# Altium project stmf417 board.PrjPcb (part 1 of 4)
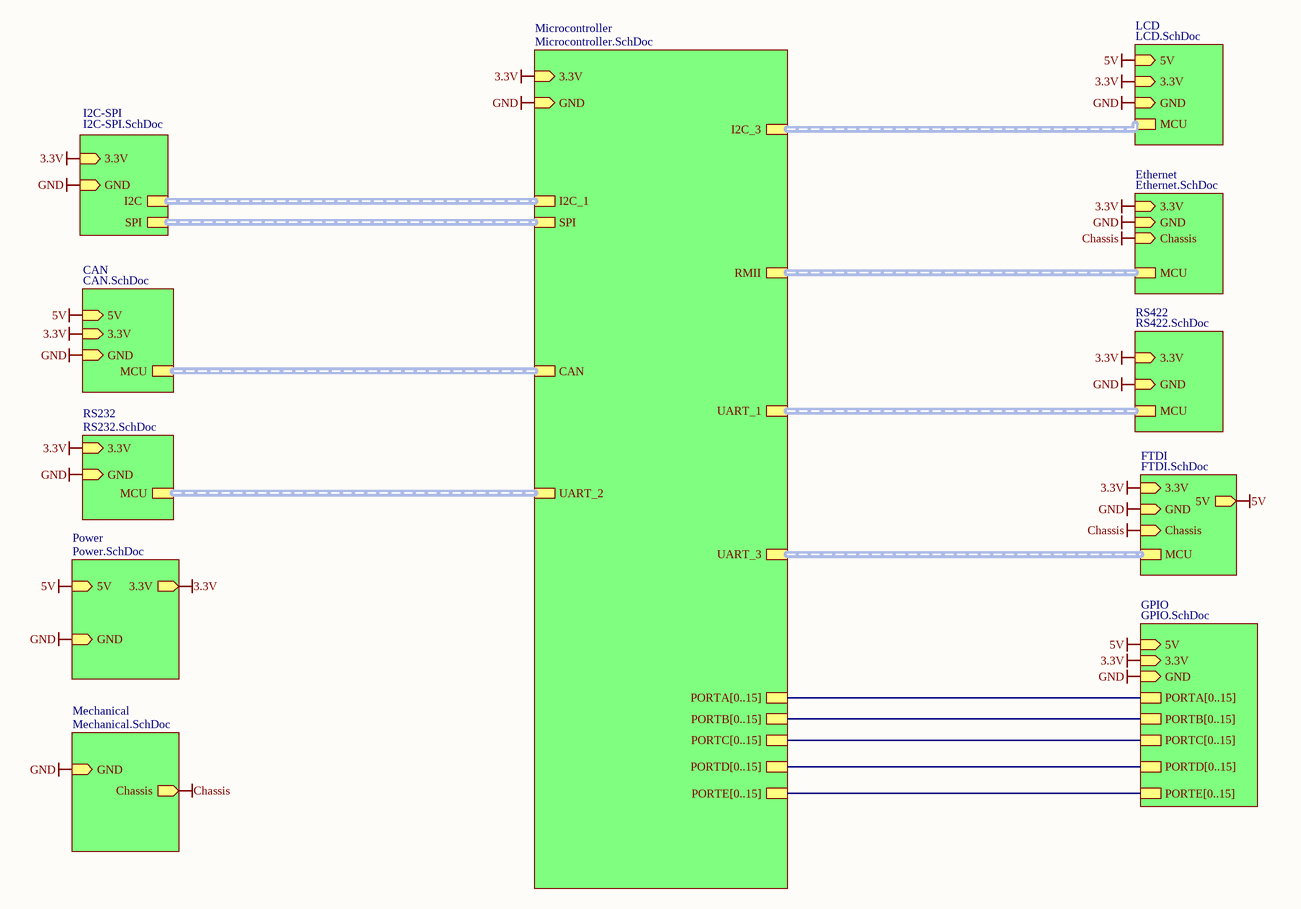
[diagram p0: main.SchDoc]
15 sheets, 357 parts. Net scope: strictly hierarchical (ports join the sheet entries above them; power ports are local).
Sheets:
  main.SchDoc
    CAN = CAN.SchDoc
    RS232 = RS232.SchDoc
    Power = Power.SchDoc
    Microcontroller = Microcontroller.SchDoc
    LCD = LCD.SchDoc
    Ethernet = Ethernet.SchDoc
    RS422 = RS422.SchDoc
    FTDI = FTDI.SchDoc
    GPIO = GPIO.SchDoc
      Bt1 = Button.SchDoc
      Bt2 = Button.SchDoc
      Bt3 = Button.SchDoc
      Sw1 = Switch.SchDoc
      Sw2 = Switch.SchDoc
      Sw3 = Switch.SchDoc
      LdR = Led Driver.SchDoc
      LdO = Led Driver.SchDoc
      LdY = Led Driver.SchDoc
      LdG = Led Driver.SchDoc
    Mechanical = Mechanical.SchDoc
    I2C-SPI = I2C-SPI.SchDoc

## Sheet main.SchDoc
size A3; SheetNumber: 1; SheetTotal: 15

### Sub-sheets
CAN = CAN.SchDoc: 3.3V (in), GND (in), MCU (harness CAN), 5V (in)
Ethernet = Ethernet.SchDoc: 3.3V (in), GND (in), MCU (harness RMII), Chassis (in)
FTDI = FTDI.SchDoc: 3.3V (in), GND (in), MCU (harness UART), 5V (out), Chassis (in)
GPIO = GPIO.SchDoc: 3.3V (in), GND (in), PORTA[0..15], PORTB[0..15], PORTC[0..15], PORTD[0..15], PORTE[0..15], 5V (in)
I2C-SPI = I2C-SPI.SchDoc: 3.3V (in), GND (in), SPI (harness SPI), I2C (harness I2C)
LCD = LCD.SchDoc: 3.3V (in), GND (in), MCU (harness I2C), 5V (in)
Mechanical = Mechanical.SchDoc: Chassis (out), GND (in)
Microcontroller = Microcontroller.SchDoc: 3.3V (in), GND (in), CAN (harness CAN), UART_2 (harness UART), SPI (harness SPI), I2C_3 (harness I2C), RMII (harness RMII), UART_1 (harness UART), UART_3 (harness UART), I2C_1 (harness I2C), PORTA[0..15], PORTB[0..15], PORTC[0..15], PORTD[0..15], PORTE[0..15]
Power = Power.SchDoc: 5V (in), GND (in), 3.3V (out)
RS232 = RS232.SchDoc: 3.3V (in), GND (in), MCU (harness UART)
RS422 = RS422.SchDoc: 3.3V (in), GND (in), MCU (harness UART)

### Nets
3.3V: sheet CAN/3.3V, sheet RS232/3.3V, sheet Power/3.3V, sheet Microcontroller/3.3V, sheet LCD/3.3V, sheet Ethernet/3.3V, sheet RS422/3.3V, sheet FTDI/3.3V, sheet GPIO/3.3V, sheet I2C-SPI/3.3V
5V: sheet CAN/5V, sheet Power/5V, sheet LCD/5V, sheet FTDI/5V, sheet GPIO/5V
Chassis: sheet Ethernet/Chassis, sheet FTDI/Chassis, sheet Mechanical/Chassis
GND: sheet CAN/GND, sheet RS232/GND, sheet Power/GND, sheet Microcontroller/GND, sheet LCD/GND, sheet Ethernet/GND, sheet RS422/GND, sheet FTDI/GND, sheet GPIO/GND, sheet Mechanical/GND, sheet I2C-SPI/GND

### Buses and harness runs
bus sheet GPIO/PORTA[0..15] = sheet Microcontroller/PORTA[0..15]
bus sheet GPIO/PORTB[0..15] = sheet Microcontroller/PORTB[0..15]
bus sheet GPIO/PORTC[0..15] = sheet Microcontroller/PORTC[0..15]
bus sheet GPIO/PORTD[0..15] = sheet Microcontroller/PORTD[0..15]
bus sheet GPIO/PORTE[0..15] = sheet Microcontroller/PORTE[0..15]
harness sheet CAN/MCU = sheet Microcontroller/CAN
harness sheet Ethernet/MCU = sheet Microcontroller/RMII
harness sheet FTDI/MCU = sheet Microcontroller/UART_3
harness sheet I2C-SPI/I2C = sheet Microcontroller/I2C_1
harness sheet I2C-SPI/SPI = sheet Microcontroller/SPI
harness sheet LCD/MCU = sheet Microcontroller/I2C_3
harness sheet Microcontroller/UART_1 = sheet RS422/MCU
harness sheet Microcontroller/UART_2 = sheet RS232/MCU

## Sheet CAN.SchDoc
size A4; SheetNumber: 2; SheetTotal: 15
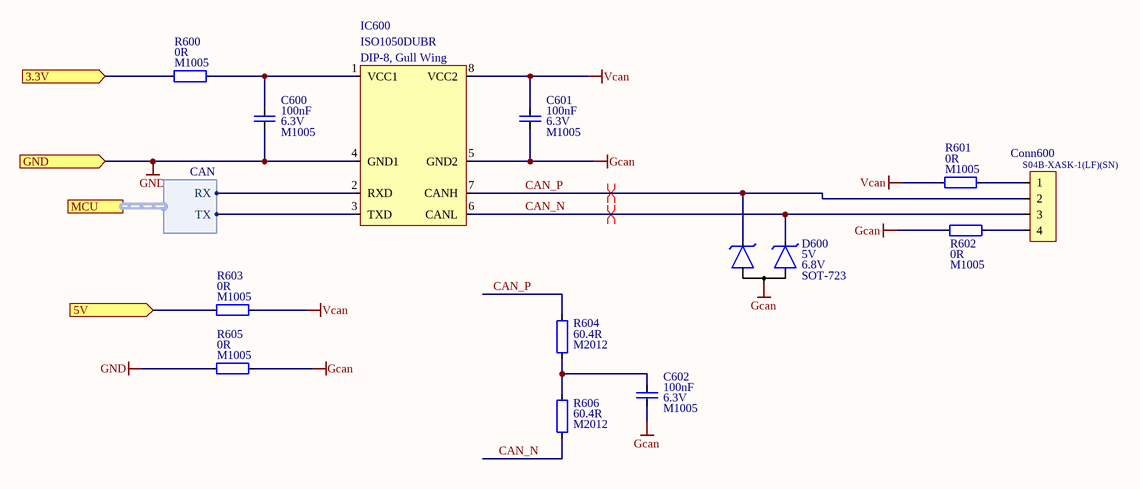
[diagram p1: CAN.SchDoc]

### Parts
C600  value 100nF  Voltage: 6.3V  Package: M1005  [Capacitor_Ceramic_M1005_I0402]  (hidden comment: Capacitor_Ceramic)
C601  value 100nF  Voltage: 6.3V  Package: M1005  [Capacitor_Ceramic_M1005_I0402]  (hidden comment: Capacitor_Ceramic)
C602  value 100nF  Voltage: 6.3V  Package: M1005  [Capacitor_Ceramic_M1005_I0402]  (hidden comment: Capacitor_Ceramic)
Conn600  Manufacturer Part Number: S04B-XASK-1(LF)(SN)  [Connector, S04B-XASK-1]  (hidden comment: Connector - 4P)
D600  Voltage, Break Down: 6.8V  Voltage, Stand Off: 5V  Package: SOT-723  [Diode_SOT-723_2P_Common_Anode_Type_1]  (hidden comment: Diode_Tvs_2P_Common_Anode)
IC600  Manufacturer Part Number: ISO1050DUBR  [DIP-8, Gull Wing]  (hidden comment: CAN - Texas, ISO1050DUB)
R600  value 0R  Package: M1005  [Resistor_Smd_M1005_I0402]  (hidden comment: Resistor)
R601  value 0R  Package: M1005  [Resistor_Smd_M1005_I0402]  (hidden comment: Resistor)
R602  value 0R  Package: M1005  [Resistor_Smd_M1005_I0402]  (hidden comment: Resistor)
R603  value 0R  Package: M1005  [Resistor_Smd_M1005_I0402]  (hidden comment: Resistor)
R604  value 60.4R  Package: M2012  [Resistor_Smd_M2012_I0805]  (hidden comment: Resistor)
R605  value 0R  Package: M1005  [Resistor_Smd_M1005_I0402]  (hidden comment: Resistor)
R606  value 60.4R  Package: M2012  [Resistor_Smd_M2012_I0805]  (hidden comment: Resistor)

### Ports
3.3V (in), 5V (in), GND (in), MCU (harness CAN)

### Harnesses
CAN: RX, TX

### Nets
3.3V: R600.1 ; port 3.3V
5V: R603.1 ; port 5V
Gcan: C601.2 C602.2 D600.A IC600.5(GND2) R602.1 R605.2
GND: C600.2 IC600.4(GND1) R605.1 ; port GND
Vcan: C601.1 IC600.8(VCC2) R601.1 R603.2
CAN_N: Conn600.3 D600.C2 IC600.6(CANL) R606.2
CAN_P: Conn600.2 D600.C1 IC600.7(CANH) R604.1
CanRx: IC600.2(RXD) ; port MCU.RX
CanTx: IC600.3(TXD) ; port MCU.TX
NetC600_1: C600.1 IC600.1(VCC1) R600.2
NetC602_1: C602.1 R604.2 R606.1
NetConn600_1: Conn600.1 R601.2
NetConn600_4: Conn600.4 R602.2

### Layout directives
differential pair: CAN_N, CAN_P

### Library data of the parts
C600-C602 = Capacitor_Ceramic: Cap, Cer, 100nF, 6.3V, M1005; Manufacturer Part Number: 04026D104KAT4A; Manufacturer: Kyocera; Temperature Coefficient: X5R; Tolerance: 10%; ComponentLink1Description: Datasheet; ComponentLink1URL: E:\Altium\Datasheets\Capacitor\Kyocera - X5R.pdf; ComponentLink2Description: Supplier Link; ComponentLink2URL: https://www.digikey.com/en/products/detail/kyocera-avx/04026D104KAT4A/8107673; Supplier: Digikey; Supplier Part Number: 478-11504-1-ND; Operating Temperature, Min: +85℃; Operating Temperature, Max: -55℃; Quantity, Min: 1; Quantity, Max: 250000; Price, Min: 0.1; Supplier Currency: $; Price, Max: 0.00189; Supplier Link: https://www.digikey.com/en/products/detail/kyocera-avx/04026D104KAT4A/8107673; Component Type: Ceramic; Component Category: Capacitor
Conn600 = Connector - 4P: Conn, JST, 4P, TH, XA, Side Entry; ComponentLink1Description: Datasheet; ComponentLink1URL: E:\Altium\Datasheets\Connector - JST\XA Family.pdf; ComponentLink2Description: Supplier Link; ComponentLink2URL: https://www.digikey.com/en/products/detail/jst-sales-america-inc/S04B-XASK-1-LF-SN/7230506; Supplier: Digikey; Supplier Part Number: 455-4090-ND; Manufacturer: JST; Operating Temperature, Min: -25℃; Operating Temperature, Max: +85℃; Quantity, Min: 1; Quantity, Max: 10000; Price, Min: 0.53; Supplier Currency: $; Price, Max: 0.22547; Supplier Link: https://www.digikey.com/en/products/detail/jst-sales-america-inc/S04B-XASK-1-LF-SN/7230506; Component Type: PCB; Component Category: Connector; Package: SMD, TH, Side Entry
D600 = Diode_Tvs_2P_Common_Anode: Diode, TVS, 5V/6.8V, SOD-723; Manufacturer Part Number: DF3A6.8LFV,L3F; Manufacturer: Toshiba; ComponentLink1Description: Datasheet; ComponentLink1URL: E:\Altium\Datasheets\Diode\Toshiba, DF3A6.8LFV.pdf; ComponentLink2Description: Supplier Link; ComponentLink2URL: https://www.digikey.com/en/products/detail/toshiba-semiconductor-and-storage/DF3A6-8LFV-L3F/4305070; Supplier: Digikey; Supplier Part Number: DF3A6.8LFVL3FCT-ND; Operating Temperature, Min: ---℃; Operating Temperature, Max: ---℃; Quantity, Min: 1; Quantity, Max: 200000; Price, Min: 0.25; Price, Max: 0.027; Supplier Currency: $; Supplier Link: https://www.digikey.com/en/products/detail/toshiba-semiconductor-and-storage/DF3A6-8LFV-L3F/4305070; Component Type: Tvs; Component Category: Diode
IC600 = CAN - Texas, ISO1050DUB: IC, Interface, CAN, DIP-8, Gull Wing; ComponentLink1Description: Datasheet; ComponentLink1URL: E:\Altium\Datasheets\IC - Interface\CAN - Texas, ISO1050.pdf; ComponentLink2Description: Supplier Link; ComponentLink2URL: https://www.digikey.com/en/products/detail/texas-instruments/ISO1050DUBR/2094633; Supplier: Digikey; Supplier Part Number: 296-24818-1-ND; Manufacturer: Texas; Operating Temperature, Min: -55℃; Operating Temperature, Max: +105℃; Quantity, Min: 1; Quantity, Max: 1050; Price, Min: 5.71; Supplier Currency: $; Price, Max: 3.25280; Supplier Link: https://www.digikey.com/en/products/detail/texas-instruments/ISO1050DUBR/2094633; Component Type: Interface; Component Category: IC; Package: DIP-8, Gull Wing
R600-R603 R605 = Resistor: Res, 0R, M1005; Manufacturer: Yageo; Manufacturer Part Number: RC0402FR-070RL; Component Category: Resistor; Component Type: Fixed Value; Tolerance: *; Supplier Link: https://www.digikey.com/en/products/detail/yageo/RC0402FR-070RL/2827570; Supplier Currency: $; Price, Max: 0.00109; Price, Min: 0.1; Quantity, Max: 50000; Quantity, Min: 1; Operating Temperature, Max: -55℃; Operating Temperature, Min: +155℃; Supplier Part Number: 311-0.0LRCT-ND; Supplier: Digikey; ComponentLink1Description: Datasheet; ComponentLink1URL: E:\Altium\Datasheets\Resistor\Yageo - RC_L Series.pdf; ComponentLink2Description: Supplier Link; ComponentLink2URL: https://www.digikey.com/en/products/detail/yageo/RC0402FR-070RL/2827570
R604 R606 = Resistor: Res, 60.4R, 1%, M1005; Manufacturer: Yageo; Manufacturer Part Number: RC0805FR-0760R4L; Component Category: Resistor; Component Type: Fixed Value; Tolerance: 1%; Supplier Link: https://www.digikey.com/en/products/detail/yageo/RC0805FR-0760R4L/728073; Supplier Currency: $; Price, Max: 0.00328; Price, Min: 0.1; Quantity, Max: 125000; Quantity, Min: 1; Operating Temperature, Max: -55℃; Operating Temperature, Min: +155℃; Supplier Part Number: 311-60.4CRCT-ND; Supplier: Digikey; ComponentLink1Description: Datasheet; ComponentLink1URL: E:\Altium\Datasheets\Resistor\Yageo - RC_L Series.pdf; ComponentLink2Description: Supplier Link; ComponentLink2URL: https://www.digikey.com/en/products/detail/yageo/RC0805FR-0760R4L/728073

## Sheet RS232.SchDoc
size A3; SheetNumber: 3; SheetTotal: 15
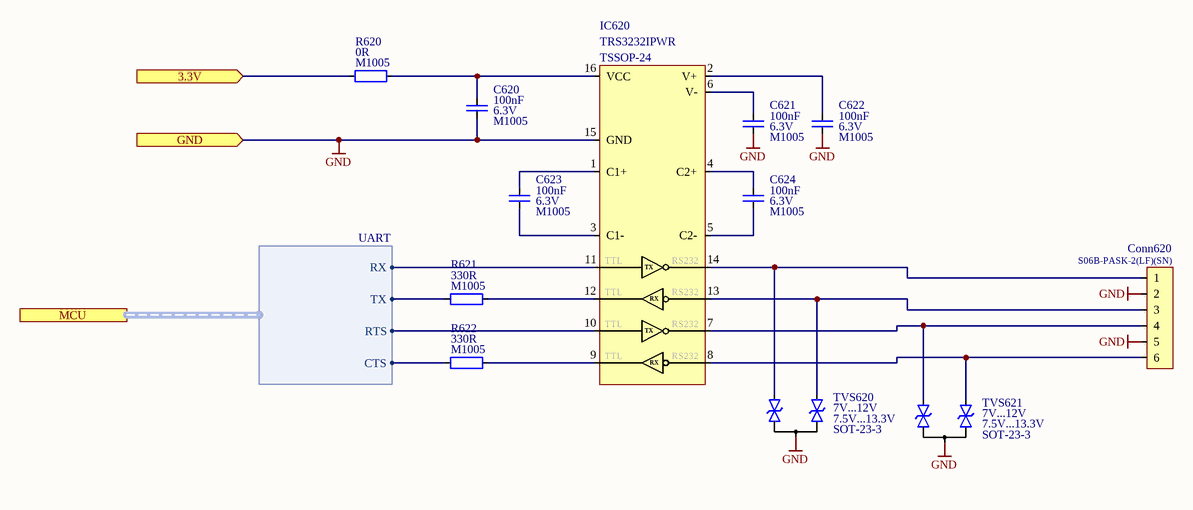
[diagram p2: RS232.SchDoc]

### Parts
C620  value 100nF  Voltage: 6.3V  Package: M1005  [Capacitor_Ceramic_M1005_I0402]  (hidden comment: Capacitor_Ceramic)
C621  value 100nF  Voltage: 6.3V  Package: M1005  [Capacitor_Ceramic_M1005_I0402]  (hidden comment: Capacitor_Ceramic)
C622  value 100nF  Voltage: 6.3V  Package: M1005  [Capacitor_Ceramic_M1005_I0402]  (hidden comment: Capacitor_Ceramic)
C623  value 100nF  Voltage: 6.3V  Package: M1005  [Capacitor_Ceramic_M1005_I0402]  (hidden comment: Capacitor_Ceramic)
C624  value 100nF  Voltage: 6.3V  Package: M1005  [Capacitor_Ceramic_M1005_I0402]  (hidden comment: Capacitor_Ceramic)
Conn620  Manufacturer Part Number: S06B-PASK-2(LF)(SN)  [Connector, S06B-PASK-2]  (hidden comment: Connector - 6P)
IC620  Manufacturer Part Number: TRS3232IPWR  Package: TSSOP-24  [TSSOP-16]  (hidden comment: RS232 - Texas, TRS3232IPWR)
R620  value 0R  Package: M1005  [Resistor_Smd_M1005_I0402]  (hidden comment: Resistor)
R621  value 330R  Package: M1005  [Resistor_Smd_M1005_I0402]  (hidden comment: Resistor)
R622  value 330R  Package: M1005  [Resistor_Smd_M1005_I0402]  (hidden comment: Resistor)
TVS620  Voltage, Break Down: 7.5V...13.3V  Voltage, Stand Off: 7V...12V  Package: SOT-23-3  [Diode_SOT-23-3_2P_Bidirectional_Type_1]  (hidden comment: Diode_Tvs_2P_Bidirectional)
TVS621  Voltage, Break Down: 7.5V...13.3V  Voltage, Stand Off: 7V...12V  Package: SOT-23-3  [Diode_SOT-23-3_2P_Bidirectional_Type_1]  (hidden comment: Diode_Tvs_2P_Bidirectional)

### Ports
3.3V (in), GND (in), MCU (harness UART)

### Harnesses
UART: RX, TX, RTS, CTS

### Nets
3.3V: R620.1 ; port 3.3V
GND: C620.2 C621.2 C622.2 Conn620.2 Conn620.5 IC620.15(GND) TVS620.Common TVS621.Common ; port GND
PA0: R622.1 ; port MCU.CTS
PA3: IC620.11(DIN1) ; port MCU.RX
PD4: IC620.10(DIN2) ; port MCU.RTS
PD5: R621.1 ; port MCU.TX
NetC620_1: C620.1 IC620.16(VCC) R620.2
NetC621_1: C621.1 IC620.6(V-)
NetC622_1: C622.1 IC620.2(V+)
NetC623_1: C623.1 IC620.1(C1+)
NetC623_2: C623.2 IC620.3(C1-)
NetC624_1: C624.1 IC620.4(C2+)
NetC624_2: C624.2 IC620.5(C2-)
NetConn620_1: Conn620.1 IC620.14(DOUT1) TVS620.D1
NetConn620_3: Conn620.3 IC620.13(RIN1) TVS620.D2
NetConn620_4: Conn620.4 IC620.7(DOUT2) TVS621.D1
NetConn620_6: Conn620.6 IC620.8(RIN2) TVS621.D2
NetIC620_9: IC620.9(ROUT2) R622.2
NetIC620_12: IC620.12(ROUT1) R621.2

### Notes on the sheet
- (in symbol RS232 - Texas, TRS3232IPWR) TTL; TX; RS232; RX

### Library data of the parts
C620-C624 = Capacitor_Ceramic: as C600 on sheet CAN; ComponentLink1Description: Datasheet; ComponentLink1URL: E:\Altium\Datasheets\Capacitor\Kyocera - X5R.pdf; ComponentLink2Description: Supplier Link; ComponentLink2URL: https://www.digikey.com/en/products/detail/kyocera-avx/04026D104KAT4A/8107673; Supplier: Digikey; Supplier Part Number: 478-11504-1-ND; Operating Temperature, Min: +85℃; Operating Temperature, Max: -55℃; Quantity, Min: 1; Quantity, Max: 250000; Price, Min: 0.1; Supplier Currency: $; Price, Max: 0.00189; Supplier Link: https://www.digikey.com/en/products/detail/kyocera-avx/04026D104KAT4A/8107673; Component Type: Ceramic; Component Category: Capacitor
Conn620 = Connector - 6P: Conn, JST, 6P, TH, PA, Side Entry; ComponentLink1Description: Datasheet; ComponentLink1URL: E:\Altium\Datasheets\Connector - JST\PA Family.pdf; ComponentLink2Description: Supplier Link; ComponentLink2URL: https://www.digikey.com/en/products/detail/jst-sales-america-inc/S06B-PASK-2-LF-SN/926757; Supplier: Digikey; Supplier Part Number: 455-1851-ND; Manufacturer: JST; Operating Temperature, Min: -25℃; Operating Temperature, Max: +85℃; Quantity, Min: 1; Quantity, Max: 10000; Price, Min: 0.51; Supplier Currency: $; Price, Max: 0.21423; Supplier Link: https://www.digikey.com/en/products/detail/jst-sales-america-inc/S06B-PASK-2-LF-SN/926757; Component Type: PCB; Component Category: Connector; Package: TH, Side
IC620 = RS232 - Texas, TRS3232IPWR: IC, Interface, RS232, TSSOP-24; ComponentLink1Description: Datasheet; ComponentLink1URL: E:\Altium\Datasheets\IC - Interface\RS232 - Texas, TRS3232.pdf; ComponentLink2Description: Supplier Link; ComponentLink2URL: https://www.digikey.com/en/products/detail/texas-instruments/TRS3232IPWR/1909117; Supplier: Digikey; Supplier Part Number: 296-24818-1-ND; Manufacturer: Texas; Operating Temperature, Min: -55℃; Operating Temperature, Max: +85℃; Quantity, Min: 1; Quantity, Max: 2000; Price, Min: 1.95; Supplier Currency: $; Price, Max: 0.9984; Supplier Link: https://www.digikey.com/en/products/detail/texas-instruments/TRS3232IPWR/1909117; Component Type: Interface; Component Category: IC
R620 = Resistor: as R600 on sheet CAN; Component Category: Resistor; Component Type: Fixed Value; Tolerance: *; Supplier Link: https://www.digikey.com/en/products/detail/yageo/RC0402FR-070RL/2827570; Supplier Currency: $; Price, Max: 0.00109; Price, Min: 0.1; Quantity, Max: 50000; Quantity, Min: 1; Operating Temperature, Max: -55℃; Operating Temperature, Min: +155℃; Supplier Part Number: 311-0.0LRCT-ND; Supplier: Digikey; ComponentLink1Description: Datasheet; ComponentLink1URL: E:\Altium\Datasheets\Resistor\Yageo - RC_L Series.pdf; ComponentLink2Description: Supplier Link; ComponentLink2URL: https://www.digikey.com/en/products/detail/yageo/RC0402FR-070RL/2827570
R621 R622 = Resistor: Res, 330R, 1%, M1005; Manufacturer: Yageo; Manufacturer Part Number: RC0402FR-07330RL; Component Category: Resistor; Component Type: Fixed Value; Tolerance: 1%; Supplier Link: https://www.digikey.com/en/products/detail/yageo/RC0402FR-07330RL/726594; Supplier Currency: $; Price, Max: 0.00129; Price, Min: 0.1; Quantity, Max: 100000; Quantity, Min: 1; Operating Temperature, Max: -55℃; Operating Temperature, Min: +155℃; Supplier Part Number: 311-330LRCT-ND; Supplier: Digikey; ComponentLink1Description: Datasheet; ComponentLink1URL: E:\Altium\Datasheets\Resistor\Yageo - RC_L Series.pdf; ComponentLink2Description: Supplier Link; ComponentLink2URL: https://www.digikey.com/en/products/detail/yageo/RC0402FR-07330RL/726594
TVS620 TVS621 = Diode_Tvs_2P_Bidirectional: TVS, 2P, Bidirectional, 7V/12V, SOT-23-3; Manufacturer Part Number: CDSOT23-SM712; Manufacturer: Bourns; Component Category: Diode; ComponentLink1Description: Datasheet; ComponentLink1URL: E:\Altium\Datasheets\Diode\Bourns, CDSOT23-SM712.pdf; ComponentLink2Description: Supplier Link; ComponentLink2URL: https://www.digikey.com/en/products/detail/bourns-inc/CDSOT23-SM712/1630592; Supplier: Digikey; Supplier Part Number: CDSOT23-SM712CT-ND; Operating Temperature, Min: -55℃; Operating Temperature, Max: +150℃; Quantity, Min: 1; Quantity, Max: 3000; Price, Min: 1.59; Price, Max: 0.675; Supplier Currency: $; Supplier Link: https://www.digikey.com/en/products/detail/bourns-inc/CDSOT23-SM712/1630592; Component Type: TVS

## Sheet Power.SchDoc
size A3; SheetNumber: 5; SheetTotal: 15
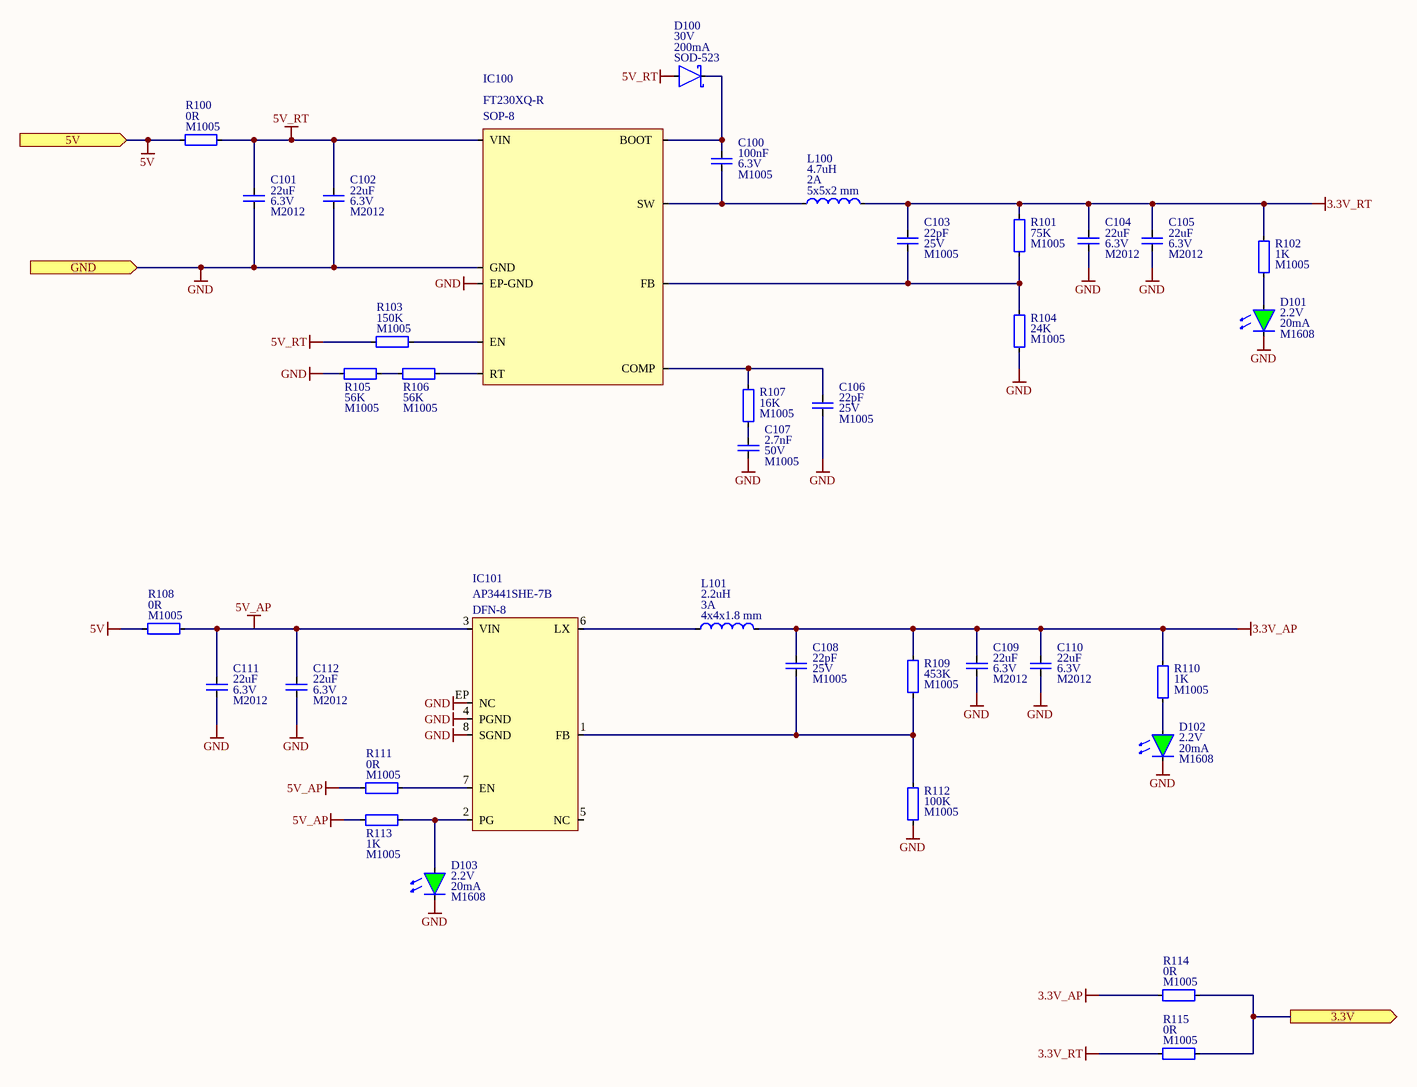
[diagram p3: Power.SchDoc]

### Parts
C100  value 100nF  Voltage: 6.3V  Package: M1005  [Capacitor_Ceramic_M1005_I0402]  (hidden comment: Capacitor_Ceramic)
C101  value 22uF  Voltage: 6.3V  Package: M2012  [Capacitor_Ceramic_M2012_I0805]  (hidden comment: Capacitor_Ceramic)
C102  value 22uF  Voltage: 6.3V  Package: M2012  [Capacitor_Ceramic_M2012_I0805]  (hidden comment: Capacitor_Ceramic)
C103  value 22pF  Voltage: 25V  Package: M1005  [Capacitor_Ceramic_M1005_I0402]  (hidden comment: Capacitor_Ceramic)
C104  value 22uF  Voltage: 6.3V  Package: M2012  [Capacitor_Ceramic_M2012_I0805]  (hidden comment: Capacitor_Ceramic)
C105  value 22uF  Voltage: 6.3V  Package: M2012  [Capacitor_Ceramic_M2012_I0805]  (hidden comment: Capacitor_Ceramic)
C106  value 22pF  Voltage: 25V  Package: M1005  [Capacitor_Ceramic_M1005_I0402]  (hidden comment: Capacitor_Ceramic)
C107  value 2.7nF  Voltage: 50V  Package: M1005  [Capacitor_Ceramic_M1005_I0402]  (hidden comment: Capacitor_Ceramic)
C108  value 22pF  Voltage: 25V  Package: M1005  [Capacitor_Ceramic_M1005_I0402]  (hidden comment: Capacitor_Ceramic)
C109  value 22uF  Voltage: 6.3V  Package: M2012  [Capacitor_Ceramic_M2012_I0805]  (hidden comment: Capacitor_Ceramic)
C110  value 22uF  Voltage: 6.3V  Package: M2012  [Capacitor_Ceramic_M2012_I0805]  (hidden comment: Capacitor_Ceramic)
C111  value 22uF  Voltage: 6.3V  Package: M2012  [Capacitor_Ceramic_M2012_I0805]  (hidden comment: Capacitor_Ceramic)
C112  value 22uF  Voltage: 6.3V  Package: M2012  [Capacitor_Ceramic_M2012_I0805]  (hidden comment: Capacitor_Ceramic)
D100  Current: 200mA  Voltage: 30V  Package: SOD-523  [Diode_SOD-523_SC-79]  (hidden comment: Diode_Schottky)
D101  Current: 20mA  Voltage: 2.2V  Package: M1608  [Diode_Smd_M1608_I0603_Green-Yellow]  (hidden comment: Diode_Led)
D102  Current: 20mA  Voltage: 2.2V  Package: M1608  [Diode_Smd_M1608_I0603_Green-Yellow]  (hidden comment: Diode_Led)
D103  Current: 20mA  Voltage: 2.2V  Package: M1608  [Diode_Smd_M1608_I0603_Green-Yellow]  (hidden comment: Diode_Led)
IC100  Manufacturer Part number: FT230XQ-R  Package: SOP-8  [Richtek, RT2862xSP,SOP-8]  (hidden comment: Richtek, RT2862xSP)
IC101  Manufacturer Part Number: AP3441SHE-7B  Package: DFN-8  [DFN-8, 2mm x 2mm, 0.5mm]  (hidden comment: Diodes, AP3441)
L100  value 4.7uH  Saturation Current: 2A  Package: 5x5x2 mm  [Taiyo Yuden - Power Inductor, 5050WK]  (hidden comment: Inductor)
L101  value 2.2uH  Saturation Current: 3A  Package: 4x4x1.8 mm  [Taiyo Yuden - Power Inductor, 4040TK]  (hidden comment: Inductor)
R100  value 0R  Package: M1005  [Resistor_Smd_M1005_I0402]  (hidden comment: Resistor)
R101  value 75K  Package: M1005  [Resistor_Smd_M1005_I0402]  (hidden comment: Resistor)
R102  value 1K  Package: M1005  [Resistor_Smd_M1005_I0402]  (hidden comment: Resistor)
R103  value 150K  Package: M1005  [Resistor_Smd_M1005_I0402]  (hidden comment: Resistor)
R104  value 24K  Package: M1005  [Resistor_Smd_M1005_I0402]  (hidden comment: Resistor)
R105  value 56K  Package: M1005  [Resistor_Smd_M1005_I0402]  (hidden comment: Resistor)
R106  value 56K  Package: M1005  [Resistor_Smd_M1005_I0402]  (hidden comment: Resistor)
R107  value 16K  Package: M1005  [Resistor_Smd_M1005_I0402]  (hidden comment: Resistor)
R108  value 0R  Package: M1005  [Resistor_Smd_M1005_I0402]  (hidden comment: Resistor)
R109  value 453K  Package: M1005  [Resistor_Smd_M1005_I0402]  (hidden comment: Resistor)
R110  value 1K  Package: M1005  [Resistor_Smd_M1005_I0402]  (hidden comment: Resistor)
R111  value 0R  Package: M1005  [Resistor_Smd_M1005_I0402]  (hidden comment: Resistor)
R112  value 100K  Package: M1005  [Resistor_Smd_M1005_I0402]  (hidden comment: Resistor)
R113  value 1K  Package: M1005  [Resistor_Smd_M1005_I0402]  (hidden comment: Resistor)
R114  value 0R  Package: M1005  [Resistor_Smd_M1005_I0402]  (hidden comment: Resistor)
R115  value 0R  Package: M1005  [Resistor_Smd_M1005_I0402]  (hidden comment: Resistor)

### Ports
3.3V (out), 5V (in), GND (in)

### Nets
3.3V: R114.2 R115.2 ; port 3.3V
3.3V_AP: C108.1 C109.1 C110.1 L101.2 R109.1 R110.1 R114.1
3.3V_RT: C103.1 C104.1 C105.1 L100.2 R101.1 R102.1 R115.1
5V: R100.1 R108.1 ; port 5V
5V_AP: C111.1 C112.1 IC101.3(VIN) R108.2 R111.1 R113.1
5V_RT: C101.1 C102.1 D100.A IC100.8-VIN(VIN) R100.2 R103.1
GND: C101.2 C102.2 C104.2 C105.2 C106.2 C107.2 C109.2 C110.2 C111.2 C112.2 D101.C D102.C D103.C IC100.4-GND(GND) IC100.EP-GND IC101.4(PGND) IC101.8(SGND) IC101.EP(NC) R104.2 R105.2 R112.2 ; port GND
NetC100_1: C100.1 D100.C IC100.2-BOOT(BOOT)
NetC100_2: C100.2 IC100.1-SW(SW) L100.1
NetC103_2: C103.2 IC100.5-FB(FB) R101.2 R104.1
NetC106_1: C106.1 IC100.6-COMP(COMP) R107.1
NetC107_1: C107.1 R107.2
NetC108_2: C108.2 IC101.1(FB) R109.2 R112.1
NetD101_A: D101.A R102.2
NetD102_A: D102.A R110.2
NetD103_A: D103.A IC101.2(PG) R113.2
NetIC100_3-EN: IC100.3-EN(EN) R103.2
NetIC100_7-RT: IC100.7-RT(RT) R106.1
NetIC101_6: IC101.6(LX) L101.1
NetIC101_7: IC101.7(EN) R111.2
NetR105_1: R105.1 R106.2

Not connected (* = marked no-connect by the designer): IC101 5(NC)

### Library data of the parts
C100 = Capacitor_Ceramic: as C600 on sheet CAN; ComponentLink1Description: Datasheet; ComponentLink1URL: E:\Altium\Datasheets\Capacitor\Kyocera - X5R.pdf; ComponentLink2Description: Supplier Link; ComponentLink2URL: https://www.digikey.com/en/products/detail/kyocera-avx/04026D104KAT4A/8107673; Supplier: Digikey; Supplier Part Number: 478-11504-1-ND; Operating Temperature, Min: +85℃; Operating Temperature, Max: -55℃; Quantity, Min: 1; Quantity, Max: 250000; Price, Min: 0.1; Supplier Currency: $; Price, Max: 0.00189; Supplier Link: https://www.digikey.com/en/products/detail/kyocera-avx/04026D104KAT4A/8107673; Component Type: Ceramic; Component Category: Capacitor
C101 C102 C104 C105 C109-C112 = Capacitor_Ceramic: Cap, Cer, 22uF, 6.3V, M2012; Manufacturer Part Number: GRM21BR60J226ME39K; Manufacturer: Murata; Temperature Coefficient: X5R; Tolerance: 20%; ComponentLink1Description: Datasheet; ComponentLink1URL: E:\Altium\Datasheets\Capacitor\Murata - Multilayer Ceramic Capacitors.pdf; ComponentLink2Description: Supplier Link; ComponentLink2URL: https://www.digikey.com/en/products/detail/murata-electronics/GRM21BR60J226ME39K/2546881; Supplier: Digikey; Supplier Part Number: 490-6471-1-ND; Operating Temperature, Min: +85℃; Operating Temperature, Max: -55℃; Quantity, Min: 1; Quantity, Max: 250000; Price, Min: 0.25; Supplier Currency: $; Price, Max: 0.02843; Supplier Link: https://www.digikey.com/en/products/detail/murata-electronics/GRM21BR60J226ME39K/2546881; Component Type: Ceramic; Component Category: Capacitor
C103 C106 C108 = Capacitor_Ceramic: Cap, Cer, 22pF, 25V, M1005; Manufacturer Part Number: 0402N220J250CT; Manufacturer: Walsin; Temperature Coefficient: C0G, NP0; Tolerance: 5%; ComponentLink1Description: Datasheet; ComponentLink1URL: E:\Altium\Datasheets\Capacitor\Walsin - Multilayer Ceramic Capacitors.pdf; ComponentLink2Description: Supplier Link; ComponentLink2URL: https://www.digikey.com/en/products/detail/walsin-technology-corporation/0402N220J250CT/9354779; Supplier: Digikey; Supplier Part Number: 1292-1282-1-ND; Operating Temperature, Min: +125℃; Operating Temperature, Max: -55℃; Quantity, Min: 1; Quantity, Max: 250000; Price, Min: 0.1; Supplier Currency: $; Price, Max: 0.00177; Supplier Link: https://www.digikey.com/en/products/detail/walsin-technology-corporation/0402N220J250CT/9354779; Component Type: Ceramic; Component Category: Capacitor
C107 = Capacitor_Ceramic: Cap, Cer, 2.7nF, 50V, M1005; Manufacturer Part Number: CC0402KRX7R9BB272; Manufacturer: Yageo; Temperature Coefficient: X7R; Tolerance: 10%; ComponentLink1Description: Datasheet; ComponentLink1URL: E:\Altium\Datasheets\Capacitor\Yageo - Surface-Mount Ceramic Multilayer Capacitors.pdf; ComponentLink2Description: Supplier Link; ComponentLink2URL: https://www.digikey.com/en/products/detail/yageo/CC0402KRX7R9BB272/302767; Supplier: Digikey; Supplier Part Number: 311-1033-1-ND; Operating Temperature, Min: +125℃; Operating Temperature, Max: -55℃; Quantity, Min: 1; Quantity, Max: 250000; Price, Min: 0.1; Supplier Currency: $; Price, Max: 0.00278; Supplier Link: https://www.digikey.com/en/products/detail/yageo/CC0402KRX7R9BB272/302767; Component Type: Ceramic; Component Category: Capacitor
D100 = Diode_Schottky: Diode, Schottky, 30V, 200mA, SOD-523; Manufacturer Part Number: CES521,L3F; Manufacturer: Toshiba; ComponentLink1Description: Datasheet; ComponentLink1URL: E:\Altium\Datasheets\Diode\Toshiba, CES521.pdf; ComponentLink2Description: Supplier Link; ComponentLink2URL: https://www.digikey.com/en/products/detail/toshiba-semiconductor-and-storage/CES521-L3F/3522356; Supplier: Digikey; Supplier Part Number: CES521L3FCT-ND; Operating Temperature, Min: ---℃; Operating Temperature, Max: +125℃; Quantity, Min: 1; Quantity, Max: 200000; Price, Min: 0.18; Price, Max: 0.018; Supplier Currency: $; Supplier Link: https://www.digikey.com/en/products/detail/toshiba-semiconductor-and-storage/CES521-L3F/3522356; Component Type: Schottky; Component Category: Diode
D101-D103 = Diode_Led: Diode, Led, Green-Yellow, 2.2V, 20mA, M1608; Manufacturer Part Number: SML-D12M1WT86; Manufacturer: Rohm; ComponentLink1Description: Datasheet; ComponentLink1URL: E:\Altium\Datasheets\Diode\Rohm, SML-D12x1 Series.pdf; ComponentLink2Description: Supplier Link; ComponentLink2URL: https://www.digikey.com/en/products/detail/rohm-semiconductor/SML-D12M1WT86/5843856; Supplier: Digikey; Supplier Part Number: SML-D12M1WT86CT-ND; Operating Temperature, Min: -40℃; Operating Temperature, Max: +85℃; Quantity, Min: 1; Quantity, Max: 75000; Price, Min: 0.25; Price, Max: 0.02838; Supplier Currency: $; Supplier Link: https://www.digikey.com/en/products/detail/rohm-semiconductor/SML-D12M1WT86/5843856; Component Type: Led; Component Category: Diode
IC100 = Richtek, RT2862xSP: IC,Interface,FTDI,QFN16; component category: capacitor*; ComponentLink1Description: datasheet; ComponentLink1URL: *; ComponentLink2Description: supplier link; ComponentLink2URL: *; component type: ceramic; supplier link: *; supplier currency: *; price,max: *; price,min: *; Quantity,max: *; Quantity,min: *; Operating Temparature,max: +85; Operating Temparature,min: -40; Supplier Part number: *; Supplier: Digikey; Manufacturer: FTDI
IC101 = Diodes, AP3441: IC, Power, Buck, DFN-8, 2x2; Manufacturer: Richtek; ComponentLink1Description: Datasheet; ComponentLink1URL: E:\Altium\Datasheets\IC - Power - DC-DC\Diodes, AP3441.pdf; ComponentLink2Description: Supplier Link; ComponentLink2URL: https://www.digikey.com/en/products/detail/diodes-incorporated/AP3441SHE-7B/9765636; Supplier: Digikey; Supplier Part Number: AP3441SHE-7BDICT-ND; Operating Temperature, Min: -40℃; Operating Temperature, Max: +85℃; Quantity, Min: 1; Quantity, Max: 30000; Price, Min: 0.54; Supplier Currency: $; Price, Max: 0.13275; Supplier Link: https://www.digikey.com/en/products/detail/diodes-incorporated/AP3441SHE-7B/9765636; Component Type: Power; Component Category: IC
L100 = Inductor: Inductor, Power, 4.7uH, 2A, 5x5x2mm; Manufacturer Part Number: NRS5020T4R7MMGJ; Manufacturer: Taiyo Yuden; ComponentLink1Description: Datasheet; ComponentLink1URL: E:\Altium\Datasheets\Inductor\Taiyo Yuden - NRx Series.pdf; ComponentLink2Description: Supplier Link; ComponentLink2URL: https://www.digikey.com/en/products/detail/taiyo-yuden/NRS5020T4R7MMGJ/2230192; Supplier: Digikey; Supplier Part Number: 587-2890-1-ND; Operating Temperature, Min: -25℃; Operating Temperature, Max: +125℃; Quantity, Min: 1; Quantity, Max: 20000; Price, Min: 0.31; Price, Max: 0.1079; Supplier Currency: $; Supplier Link: https://www.digikey.com/en/products/detail/taiyo-yuden/NRS5020T4R7MMGJ/2230192; Component Type: Power Inductor; Component Category: Inductor
L101 = Inductor: Inductor, Power, 2.2uH, 3A, 4x4x1.8mm; Manufacturer Part Number: NRS4018T2R2MDGJ; Manufacturer: Taiyo Yuden; ComponentLink1Description: Datasheet; ComponentLink1URL: E:\Altium\Datasheets\Inductor\Taiyo Yuden - NRx Series.pdf; ComponentLink2Description: Supplier Link; ComponentLink2URL: https://www.digikey.com/en/products/detail/taiyo-yuden/NRS4018T2R2MDGJ/2648968; Supplier: Digikey; Supplier Part Number: 587-2890-1-ND; Operating Temperature, Min: -25℃; Operating Temperature, Max: +120℃; Quantity, Min: 1; Quantity, Max: 87500; Price, Min: 0.27; Price, Max: 0.08633; Supplier Currency: $; Supplier Link: https://www.digikey.com/en/products/detail/taiyo-yuden/NRS4018T2R2MDGJ/2648968; Component Type: Power Inductor; Component Category: Inductor
R100 R108 R111 R114 R115 = Resistor: as R600 on sheet CAN; Component Category: Resistor; Component Type: Fixed Value; Tolerance: *; Supplier Link: https://www.digikey.com/en/products/detail/yageo/RC0402FR-070RL/2827570; Supplier Currency: $; Price, Max: 0.00109; Price, Min: 0.1; Quantity, Max: 50000; Quantity, Min: 1; Operating Temperature, Max: -55℃; Operating Temperature, Min: +155℃; Supplier Part Number: 311-0.0LRCT-ND; Supplier: Digikey; ComponentLink1Description: Datasheet; ComponentLink1URL: E:\Altium\Datasheets\Resistor\Yageo - RC_L Series.pdf; ComponentLink2Description: Supplier Link; ComponentLink2URL: https://www.digikey.com/en/products/detail/yageo/RC0402FR-070RL/2827570
R101 = Resistor: Res, 75K, 1%, M1005; Manufacturer: Yageo; Manufacturer Part Number: RC0402FR-0775KL; Component Category: Resistor; Component Type: Fixed Value; Tolerance: 1%; Supplier Link: https://www.digikey.com/en/products/detail/yageo/RC0402FR-0775KL/2827576; Supplier Currency: $; Price, Max: 0.00129; Price, Min: 0.1; Quantity, Max: 100000; Quantity, Min: 1; Operating Temperature, Max: -55℃; Operating Temperature, Min: +155℃; Supplier Part Number: 311-75KLRCT-ND; Supplier: Digikey; ComponentLink1Description: Datasheet; ComponentLink1URL: E:\Altium\Datasheets\Resistor\Yageo - RC_L Series.pdf; ComponentLink2Description: Supplier Link; ComponentLink2URL: https://www.digikey.com/en/products/detail/yageo/RC0402FR-0775KL/2827576
R102 R110 R113 = Resistor: Res, 1K, 1%, M1005; Manufacturer: Yageo; Manufacturer Part Number: RC0402FR-071KP; Component Category: Resistor; Component Type: Fixed Value; Tolerance: 1%; Supplier Link: https://www.digikey.com/en/products/detail/yageo/RC0402FR-071KP/4935269; Supplier Currency: $; Price, Max: 0.00282; Price, Min: 0.1; Quantity, Max: 100000; Quantity, Min: 1; Operating Temperature, Max: -55℃; Operating Temperature, Min: +155℃; Supplier Part Number: YAG1254CT-ND; Supplier: Digikey; ComponentLink1Description: Datasheet; ComponentLink1URL: E:\Altium\Datasheets\Resistor\Yageo - RC_L Series.pdf; ComponentLink2Description: Supplier Link; ComponentLink2URL: https://www.digikey.com/en/products/detail/yageo/RC0402FR-071KP/4935269
R103 = Resistor: Res, 150K, 1%, M1005; Manufacturer: Yageo; Manufacturer Part Number: RC0402FR-07150KL; Component Category: Resistor; Component Type: Fixed Value; Tolerance: 1%; Supplier Link: https://www.digikey.com/en/products/detail/yageo/RC0402FR-07150KL/726542; Supplier Currency: $; Price, Max: 0.00129; Price, Min: 0.1; Quantity, Max: 100000; Quantity, Min: 1; Operating Temperature, Max: -55℃; Operating Temperature, Min: +155℃; Supplier Part Number: 311-150KLRCT-ND; Supplier: Digikey; ComponentLink1Description: Datasheet; ComponentLink1URL: E:\Altium\Datasheets\Resistor\Yageo - RC_L Series.pdf; ComponentLink2Description: Supplier Link; ComponentLink2URL: https://www.digikey.com/en/products/detail/yageo/RC0402FR-07150KL/726542
R104 = Resistor: Res, 24K, 1%, M1005; Manufacturer: Yageo; Manufacturer Part Number: RC0402FR-0724KL; Component Category: Resistor; Component Type: Fixed Value; Tolerance: 1%; Supplier Link: https://www.digikey.com/en/products/detail/yageo/RC0402FR-0724KL/2827581; Supplier Currency: $; Price, Max: 0.00129; Price, Min: 0.1; Quantity, Max: 100000; Quantity, Min: 1; Operating Temperature, Max: -55℃; Operating Temperature, Min: +155℃; Supplier Part Number: 311-24KLRCT-ND; Supplier: Digikey; ComponentLink1Description: Datasheet; ComponentLink1URL: E:\Altium\Datasheets\Resistor\Yageo - RC_L Series.pdf; ComponentLink2Description: Supplier Link; ComponentLink2URL: https://www.digikey.com/en/products/detail/yageo/RC0402FR-0724KL/2827581
R105 R106 = Resistor: Res, 56K, 1%, M1005; Manufacturer: Yageo; Manufacturer Part Number: RC0402FR-0756KL; Component Category: Resistor; Component Type: Fixed Value; Tolerance: 1%; Supplier Link: https://www.digikey.com/en/products/detail/yageo/RC0402FR-0756KL/726635; Supplier Currency: $; Price, Max: 0.00129; Price, Min: 0.1; Quantity, Max: 100000; Quantity, Min: 1; Operating Temperature, Max: -55℃; Operating Temperature, Min: +155℃; Supplier Part Number: 311-56.0KLRCT-ND; Supplier: Digikey; ComponentLink1Description: Datasheet; ComponentLink1URL: E:\Altium\Datasheets\Resistor\Yageo - RC_L Series.pdf; ComponentLink2Description: Supplier Link; ComponentLink2URL: https://www.digikey.com/en/products/detail/yageo/RC0402FR-0756KL/726635
R107 = Resistor: Res, 16K, 1%, M1005; Manufacturer: Yageo; Manufacturer Part Number: RC0402FR-0716KL; Component Category: Resistor; Component Type: Fixed Value; Tolerance: 1%; Supplier Link: https://www.digikey.com/en/products/detail/yageo/RC0402FR-0716KL/726544; Supplier Currency: $; Price, Max: 0.00129; Price, Min: 0.1; Quantity, Max: 100000; Quantity, Min: 1; Operating Temperature, Max: -55℃; Operating Temperature, Min: +155℃; Supplier Part Number: 311-16.0KLRCT-ND; Supplier: Digikey; ComponentLink1Description: Datasheet; ComponentLink1URL: E:\Altium\Datasheets\Resistor\Yageo - RC_L Series.pdf; ComponentLink2Description: Supplier Link; ComponentLink2URL: https://www.digikey.com/en/products/detail/yageo/RC0402FR-0716KL/726544
R109 = Resistor: Res, 453K, 1%, M1005; Manufacturer: Yageo; Manufacturer Part Number: RC0402FR-07453KL; Component Category: Resistor; Component Type: Fixed Value; Tolerance: 1%; Supplier Link: https://www.digikey.com/en/products/detail/yageo/RC0402FR-07453KL/5281024; Supplier Currency: $; Price, Max: 0.00129; Price, Min: 0.1; Quantity, Max: 100000; Quantity, Min: 1; Operating Temperature, Max: -55℃; Operating Temperature, Min: +155℃; Supplier Part Number: YAG3164CT-ND; Supplier: Digikey; ComponentLink1Description: Datasheet; ComponentLink1URL: E:\Altium\Datasheets\Resistor\Yageo - RC_L Series.pdf; ComponentLink2Description: Supplier Link; ComponentLink2URL: https://www.digikey.com/en/products/detail/yageo/RC0402FR-07453KL/5281024
R112 = Resistor: Res, 100K, 1%, M1005; Manufacturer: Yageo; Manufacturer Part Number: RC0402FR-07100KP; Component Category: Resistor; Component Type: Fixed Value; Tolerance: 1%; Supplier Link: https://www.digikey.com/en/products/detail/yageo/RC0402FR-07100KP/12698883; Supplier Currency: $; Price, Max: 0.00282; Price, Min: 0.1; Quantity, Max: 100000; Quantity, Min: 1; Operating Temperature, Max: -55℃; Operating Temperature, Min: +155℃; Supplier Part Number: 13-RC0402FR-07100KPCT-ND; Supplier: Digikey; ComponentLink1Description: Datasheet; ComponentLink1URL: E:\Altium\Datasheets\Resistor\Yageo - RC_L Series.pdf; ComponentLink2Description: Supplier Link; ComponentLink2URL: https://www.digikey.com/en/products/detail/yageo/RC0402FR-07100KP/12698883